# EAGLE schematic VX2212-REV-B (EAGLE 6.4)
CHECKED: R.STARR; DATABASE: ./bom/partsdb.txt; DATE: XX/XX/XX; DRAWN: R.STARR; DRGNO: ED-2XXX.100; REV: B

## Sheet 1 of 2
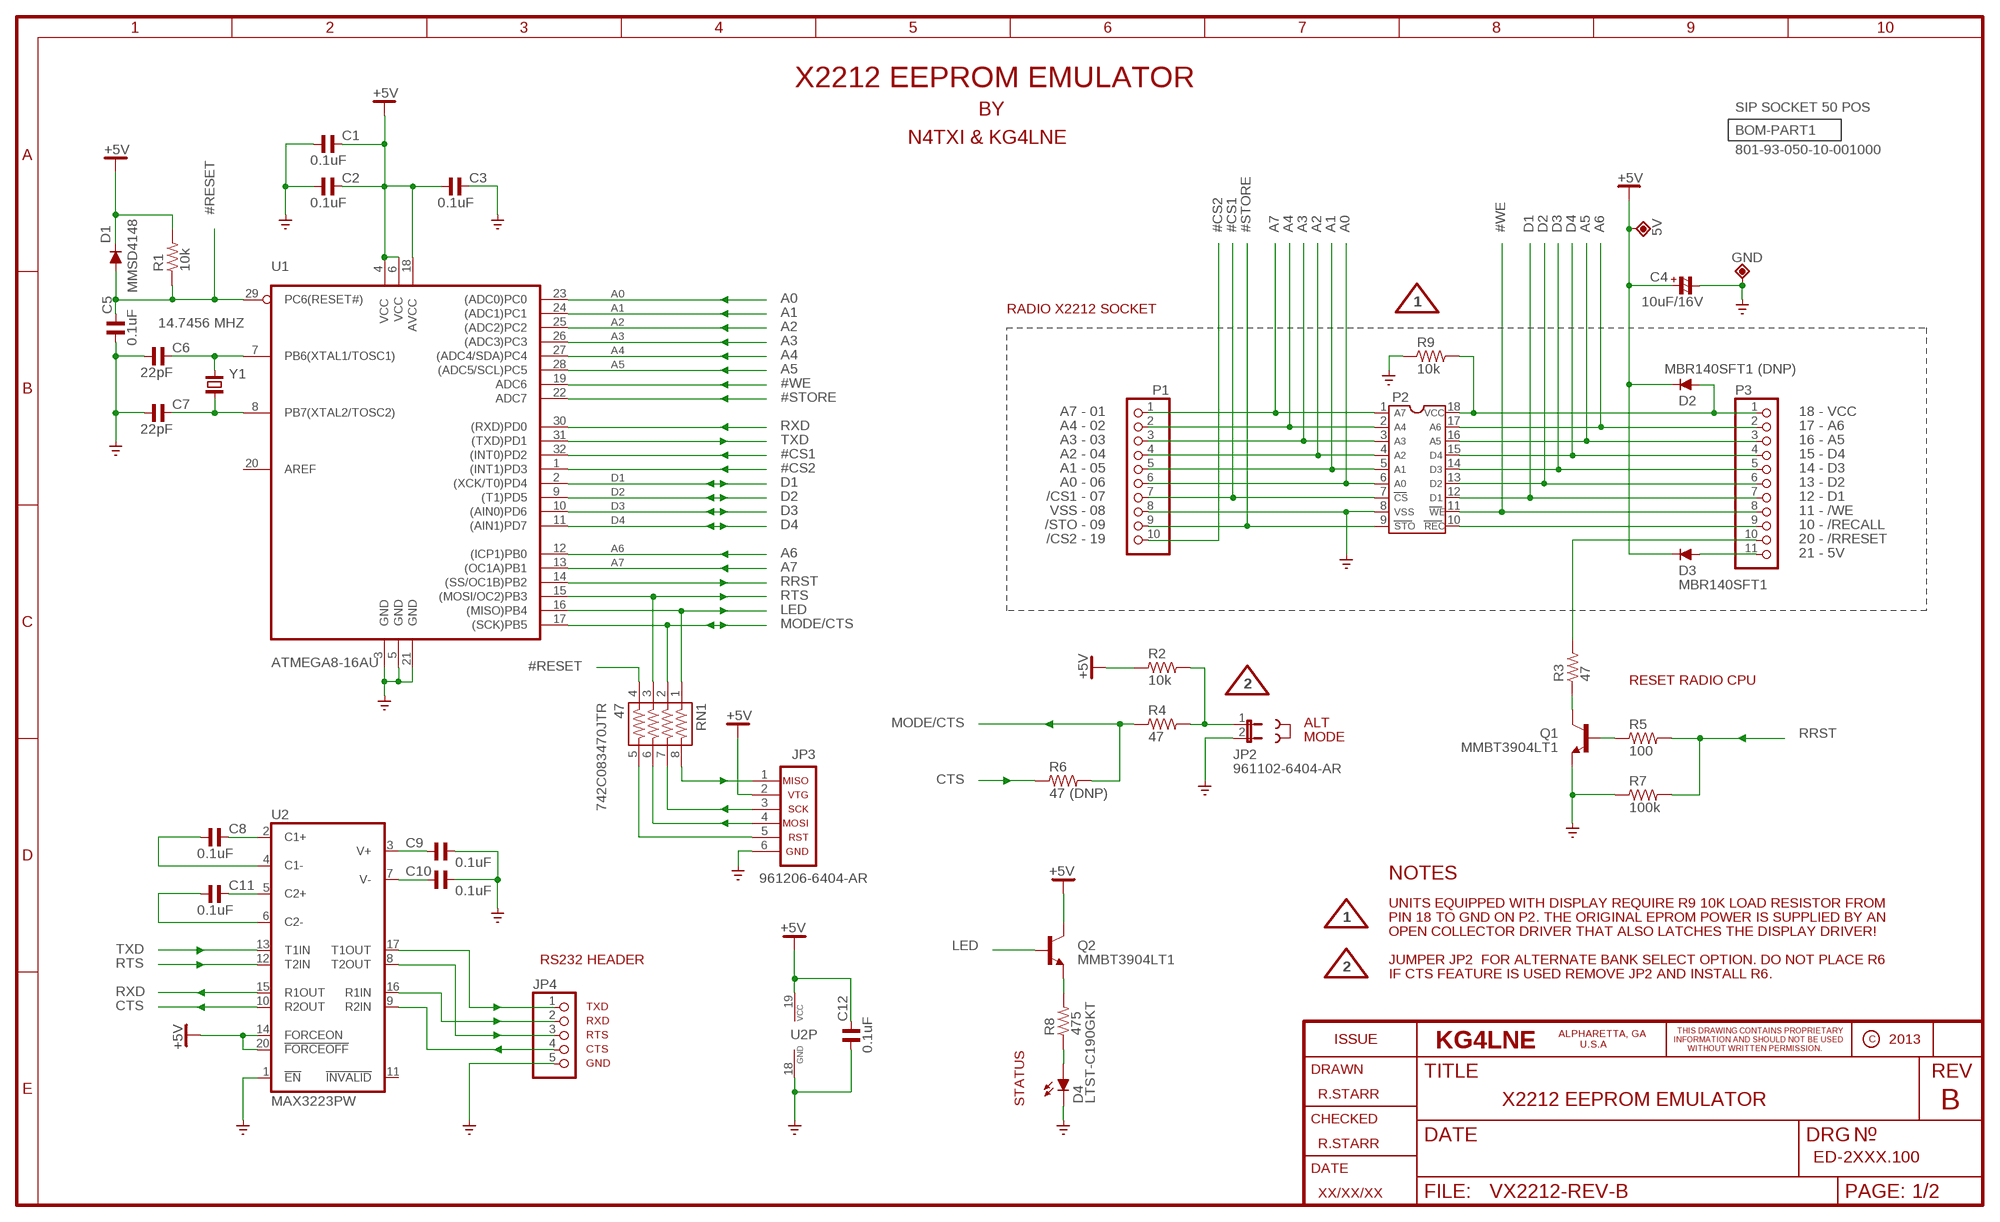
[diagram p0: schematic, sheet 1]
BOM-PART1 (BOM-PART): BOM: INCLUDE; DESC: SIP SOCKET 50 POS; PARTNO: 801-93-050-10-001000; QTY: 1
JMP2 (JUMPER): PARTNO: 969102-0000-DA

### Parts
5V  TPP-SMD-08SN  [SMD-08SN]
C1  0.1uF  C_0603  [C0603]
C2  0.1uF  C_0603  [C0603]
C3  0.1uF  C_0603  [C0603]
C4  10uF/16V  CP_3528  [C3528/T]
C5  0.1uF  C_0603  [C0603]
C6  22pF  C_0603  [C0603]
C7  22pF  C_0603  [C0603]
C8  0.1uF  C_0603  [C0603]
C9  0.1uF  C_0603  [C0603]
C10  0.1uF  C_0603  [C0603]
C11  0.1uF  C_0603  [C0603]
C12  0.1uF  C_0603  [C0603]
D1  MMSD4148  [SOD123]
D2  MBR140SFT1 (DNP)  DIODE-SOD123LF  [SOD123LF]
D3  MBR140SFT1  DIODE-SOD123LF  [SOD123LF]
D4  LTST-C190GKT  LEDCHIPLED_0603  [CHIPLED_0603]
GND  TPP-SMD-08SN  [SMD-08SN]
JP2  961102-6404-AR  JP1E  [JP1]
JP3  961206-6404-AR  AVR-ISP-6  [AVR-ISP-6]
JP4  PINHD-1X5  [1X05]
P1  PINHD-1X10  [1X10]
P2  DIL18-NS  [DIL18-NS]
P3  PINHD-1X11  [1X11]
Q1  MMBT3904LT1  [SOT23-BEC]
Q2  MMBT3904LT1  [SOT23-BEC]
R1  10k  R_0603  [R0603]
R2  10k  R_0603  [R0603]
R3  47  R_0603  [R0603]
R4  47  R_0603  [R0603]
R5  100  R_0603  [R0603]
R6  47 (DNP)  R_0603  [R0603]
R7  100k  R_0603  [R0603]
R8  475  R_0603  [R0603]
R9  10k  R_0603  [R0603]
RN1  47  742-8  [742-8]
U1  ATMEGA8-16AU  MEGA8-AI  [TQFP32-08]
U2  MAX3223PW  [TSSOP20]
Y1  14.7456 MHZ  CRYTALTC39H  [TC39H]

### Nets
#CS1: P1.7 P2.7 U1.32((INT0)PD2)
#CS2: P1.10 U1.1((INT1)PD3)
#RECALL: P2.10 P3.9
#RESET: C5.2 D1.A R1.1 RN1.4 U1.29(PC6(RESET#))
#STORE: P1.9 P2.9 U1.22(ADC7)
#WE: P2.11 P3.8 U1.19(ADC6)
+5V [VCC]: 5V.TP C1.2 C2.2 C3.1 C4.+ C12.2 D1.C D2.C D3.C JP3.2 Q2.C R1.2 R2.1 U1.4(VCC) U1.6(VCC1) U1.18(AVCC) U2.14(FORCEON) U2.19(VCC) U2.20(!FORCEOFF!)
A0: P1.6 P2.6 U1.23((ADC0)PC0)
A1: P1.5 P2.5 U1.24((ADC1)PC1)
A2: P1.4 P2.4 U1.25((ADC2)PC2)
A3: P1.3 P2.3 U1.26((ADC3)PC3)
A4: P1.2 P2.2 U1.27((ADC4/SDA)PC4)
A5: P2.16 P3.3 U1.28((ADC5/SCL)PC5)
A6: P2.17 P3.2 U1.12((ICP1)PB0)
A7: P1.1 P2.1 U1.13((OC1A)PB1)
CTS: R6.1 U2.10(R2OUT)
D1: P2.12 P3.7 U1.2((XCK/T0)PD4)
D2: P2.13 P3.6 U1.9((T1)PD5)
D3: P2.14 P3.5 U1.10((AIN0)PD6)
D4: P2.15 P3.4 U1.11((AIN1)PD7)
GND: C1.1 C2.1 C3.2 C4.- C5.1 C6.1 C7.1 C9.2 C10.2 C12.1 D4.C GND.TP JP2.2 JP3.6 JP4.5 P1.8 P2.8 Q1.E R7.1 R9.1 U1.3(GND) U1.5(GND1) U1.21(GND2) U2.1(!EN!) U2.18(GND) ; supply symbol labelled GND_
LED: Q2.B RN1.1 U1.16((MISO)PB4)
MODE/CTS: R4.1 R6.2 RN1.2 U1.17((SCK)PB5)
N$1: JP4.1 U2.17(T1OUT)
N$2: JP3.1 RN1.8
N$3: C11.2 U2.5(C2+)
N$4: D4.A R8.1
N$5: JP3.4 RN1.6
N$6: JP3.3 RN1.7
N$7: JP4.3 U2.8(T2OUT)
N$8: JP4.2 U2.16(R1IN)
N$9: C8.2 U2.2(C1+)
N$10: C10.1 U2.7(V-)
N$11: C9.1 U2.3(V+)
N$12: C8.1 U2.4(C1-)
N$13: C11.1 U2.6(C2-)
N$14: P3.10 R3.2
N$15 [VCC]: D2.A P2.18 P3.1 R9.2
N$16: JP4.4 U2.9(R2IN)
N$17: Q2.E R8.2
N$18: Q1.C R3.1
N$20: JP2.1 R2.2 R4.2
N$22: D3.A P3.11
N$23: JP3.5 RN1.5
N$26: Q1.B R5.1
N$30: C7.2 U1.8(PB7(XTAL2/TOSC2)) Y1.2
N$38: C6.2 U1.7(PB6(XTAL1/TOSC1)) Y1.1
RRST: R5.2 R7.2 U1.14((SS/OC1B)PB2)
RTS: RN1.3 U1.15((MOSI/OC2)PB3) U2.12(T2IN)
RXD: U1.30((RXD)PD0) U2.15(R1OUT)
TXD: U1.31((TXD)PD1) U2.13(T1IN)
Unconnected: U1.20(AREF) U2.11(!INVALID!)

### Notes on the sheet
- X2212 EEPROM EMULATOR
- BY
- N4TXI & KG4LNE
- RADIO X2212 SOCKET
- A7 - 01 | A7 | VCC | 18 - VCC
- A4 - 02 | A4 | A6 | 17 - A6
- A3 - 03 | A3 | A5 | 16 - A5
- A2 - 04 | A2 | D4 | 15 - D4
- A1 - 05 | A1 | D3 | 14 - D3
- A0 - 06 | A0 | D2 | 13 - D2
- /CS1 - 07 | CS | D1 | 12 - D1
- VSS - 08 | VSS | WE | 11 - /WE
- /STO - 09 | STO | REC | 10 - /RECALL
- /CS2 - 19 | 20 - /RRESET
- 21 - 5V
- RESET RADIO CPU
- 742C083470JTR
- ALT
- MODE
- NOTES
- UNITS EQUIPPED WITH DISPLAY REQUIRE R9 10K LOAD RESISTOR FROM
- PIN 18 TO GND ON P2. THE ORIGINAL EPROM POWER IS SUPPLIED BY AN
- OPEN COLLECTOR DRIVER THAT ALSO LATCHES THE DISPLAY DRIVER!
- RS232 HEADER | JUMPER JP2  FOR ALTERNATE BANK SELECT OPTION. DO NOT PLACE R6
- IF CTS FEATURE IS USED REMOVE JP2 AND INSTALL R6.
- TXD
- RXD
- RTS
- CTS
- GND
- STATUS | X2212 EEPROM EMULATOR

## Sheet 2 of 2
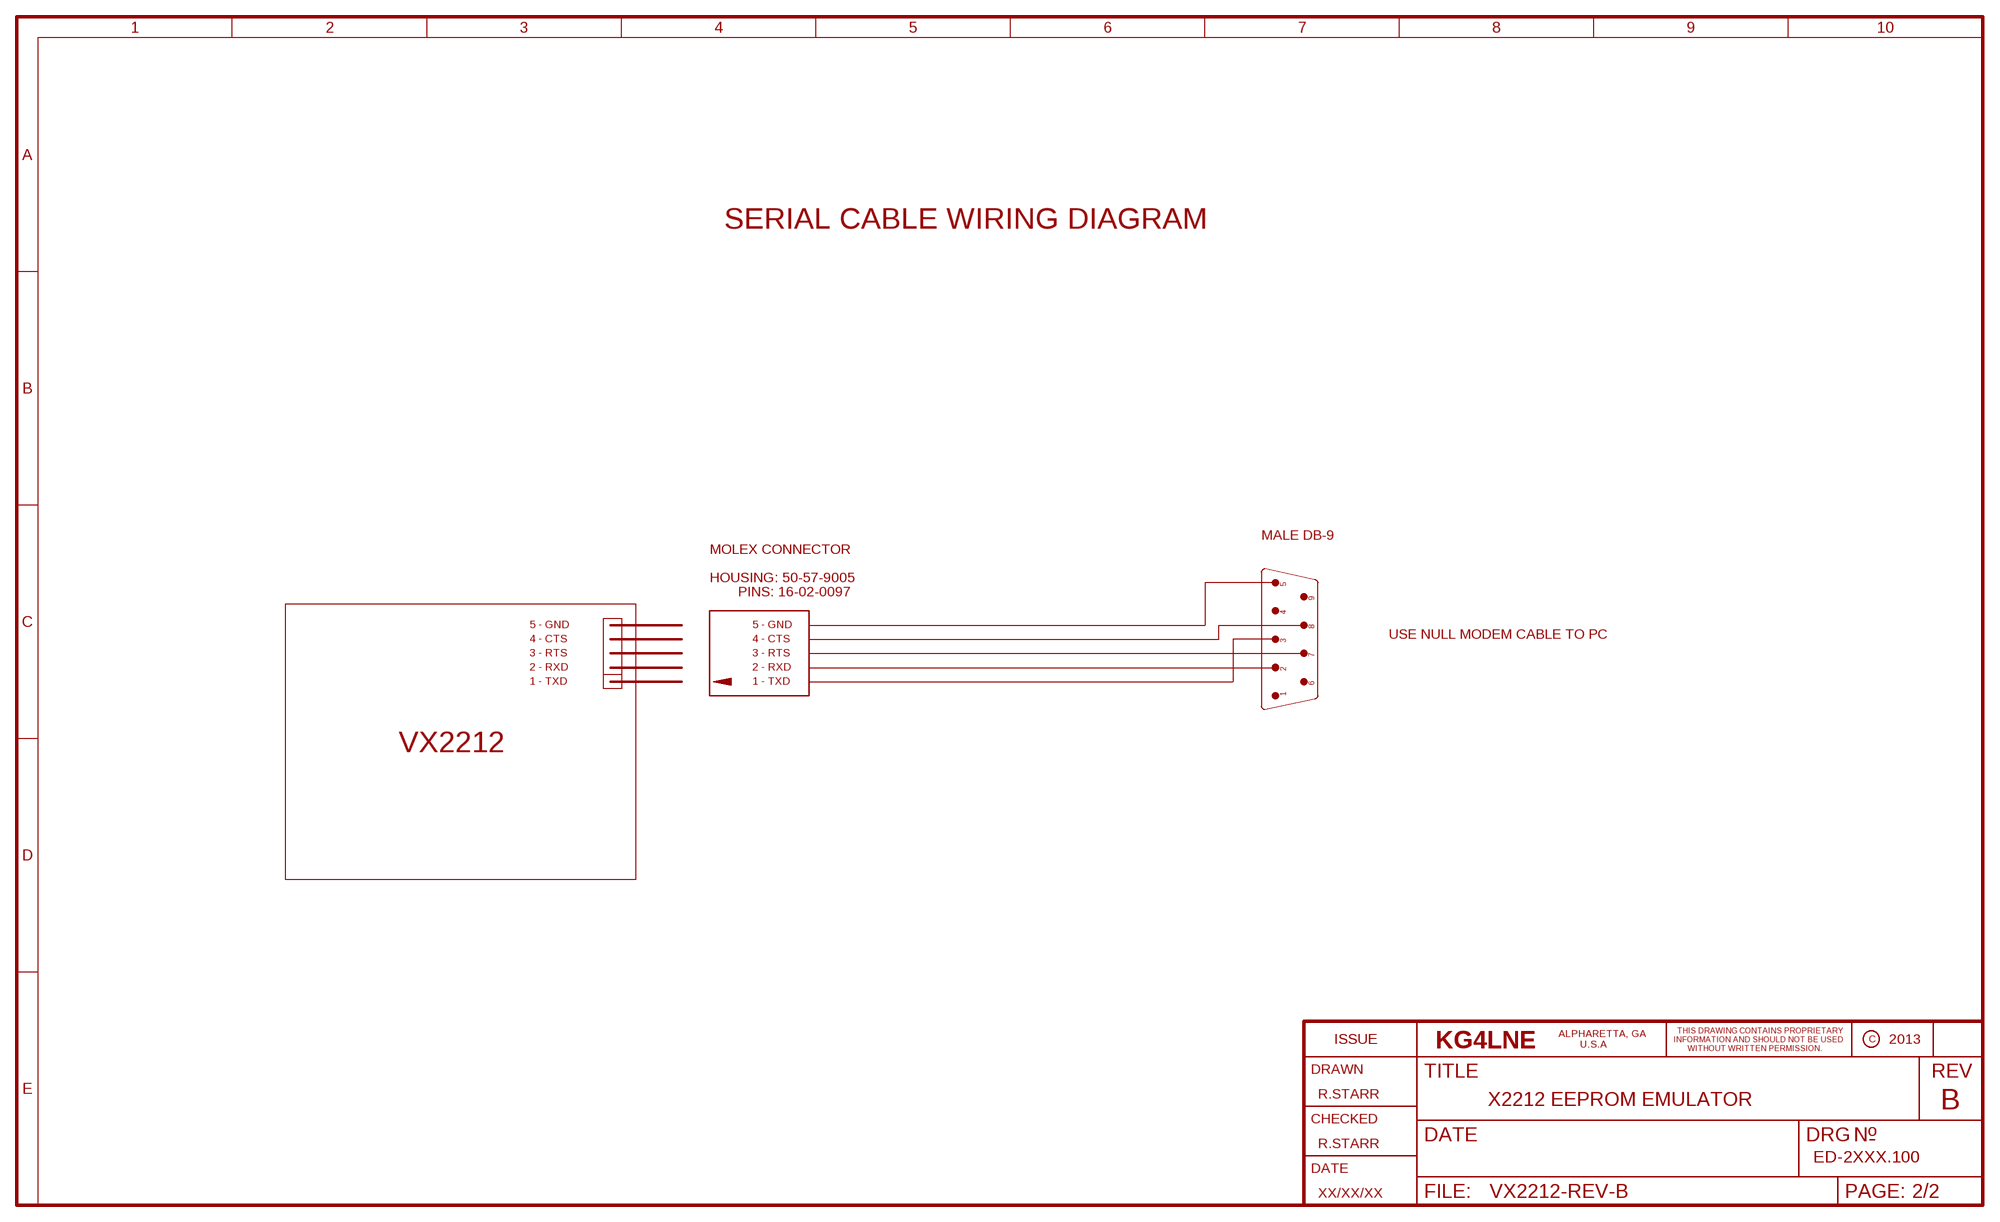
[diagram p1: schematic, sheet 2]

### Notes on the sheet
- SERIAL CABLE WIRING DIAGRAM
- MALE DB-9
- MOLEX CONNECTOR
- HOUSING: 50-57-9005
- 5
- PINS: 16-02-0097
- 9
- 4
- 5 - GND | 5 - GND | 8
- USE NULL MODEM CABLE TO PC
- 4 - CTS | 4 - CTS | 3
- 3 - RTS | 3 - RTS | 7
- 2 - RXD | 2 - RXD | 2
- 1 - TXD | 1 - TXD | 6
- 1
- VX2212
- X2212 EEPROM EMULATOR

## Library data of the parts
5V GND = testpoint:TPP: TEST POINT PAD; BOM: EXCLUDE
C1-C3 C5 C8-C12 = rc-master:C_: NON-POLARIZED CAP; PARTNO: CC0603KRX7R9BB104
C4 = rc-master:CP_: POLARIZED CAP; PARTNO: T491B106K016AT
C6 C7 = rc-master:C_: NON-POLARIZED CAP; PARTNO: CC0603JRNPO9BN220
D1 = diode:MMSD4148: DIODE ON Semiconductor, 100V, 1Vf, SOD-123; PARTNO: MMSD4148
D2 = diode:DIODE-: DIODE; PARTNO: DNP
D3 = diode:DIODE-: DIODE; PARTNO: MBR140SFT1G
D4 = led:LED: LED Various Types; PARTNO: LTST-C190GKT
JP2 = jumper:JP1E: JUMPER; PARTNO: 961102-6404-AR
JP3 = atmel:AVR-ISP-6: AVR ISP-6 Serial Programming Header; PARTNO: 961206-6404-AR
JP4 = pinhead:PINHD-1X5: PIN HEADER; BOM: EXCLUDE
P1 = pinhead:PINHD-1X10: PIN HEADER; BOM: EXCLUDE
P2 = ic-package:DIL18: Dual In Line; BOM: EXCLUDE
P3 = pinhead:PINHD-1X11: PIN HEADER; BOM: EXCLUDE
Q1 Q2 = transistor-npn:MMBT3904*: NPN TRANSISTOR; PARTNO: MMBT3904LT1
R1 R2 R9 = rc-master:R_: RESISTOR; PARTNO: ERJ-3EKF1002V
R3 R4 = rc-master:R_: RESISTOR; PARTNO: ERJ-3EKF47R5V
R5 = rc-master:R_: RESISTOR; PARTNO: ERJ-3EKF1000V
R6 = rc-master:R_: RESISTOR; PARTNO: DNP
R7 = rc-master:R_: RESISTOR; PARTNO: ERJ-3EKF1003V
R8 = rc-master:R_: RESISTOR; PARTNO: ERJ-3EKF4750V
RN1 = resistor-array:742-8: CTS 742 Series 8 Terminations, 4 Resistors; PARTNO: 742C083470JTR
U1 = atmel:MEGA8: MICROCONTROLLER 8 Kbytes FLASH 1 kbytes SRAM 512 bytes EEPROM USART 6-channel 10 bit ADC 2-channel 8 bit ADC; PARTNO: ATMEGA8-16AU
U2 = maxim:MAX3223*: RS-232 Transceiver 1µA Supply-Current, True +3V to +5.5V http://dbserv.maxim-ic.com/; PARTNO: MAX3223IPWR
Y1 = crystal:CRYTAL: CRYSTAL; PARTNO: ECS-147.4-18-9X

## Net classes
1 VCC: width 0.178 mm